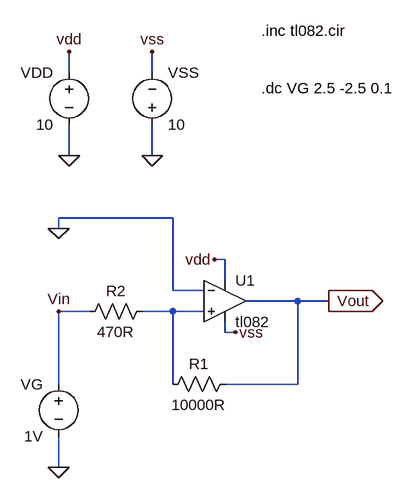
[diagram p0: schematic regfeedback.asc]
regfeedback.asc, the LTspice schematic file:
Version 4
SHEET 1 948 680
WIRE -64 -176 -64 -208
WIRE 64 -176 64 -208
WIRE -64 -48 -64 -96
WIRE 64 -48 64 -96
WIRE 96 48 -80 48
WIRE -80 64 -80 48
WIRE 176 112 160 112
WIRE 176 144 176 112
WIRE 96 160 96 48
WIRE 144 160 96 160
WIRE 288 176 208 176
WIRE 336 176 288 176
WIRE -32 192 -80 192
WIRE 96 192 48 192
WIRE 144 192 96 192
WIRE 176 224 176 208
WIRE 192 224 176 224
WIRE -80 304 -80 192
WIRE 96 304 96 192
WIRE 288 304 288 176
WIRE 288 304 176 304
WIRE -80 432 -80 384
FLAG -80 432 0
FLAG -64 -48 0
FLAG 64 -48 0
FLAG -64 -208 vdd
FLAG 160 112 vdd
FLAG 64 -208 vss
FLAG 192 224 vss
FLAG -80 192 Vin
FLAG -80 64 0
FLAG 336 176 Vout
IOPIN 336 176 Out
SYMBOL voltage -80 288 M0
WINDOW 123 0 0 Left 0
WINDOW 39 0 0 Left 0
SYMATTR InstName VG
SYMATTR Value 1V
SYMBOL voltage -64 -192 M0
SYMATTR InstName VDD
SYMATTR Value 10
SYMBOL voltage 64 -80 M180
WINDOW 0 24 96 Left 2
WINDOW 3 24 16 Left 2
SYMATTR InstName VSS
SYMATTR Value 10
SYMBOL Opamps\\opamp2 176 112 R0
SYMATTR InstName U1
SYMATTR Value tl082
SYMBOL res 192 288 R90
WINDOW 0 0 56 VBottom 2
WINDOW 3 32 56 VTop 2
SYMATTR InstName R1
SYMATTR Value 10000R
SYMBOL res 64 176 R90
WINDOW 0 0 56 VBottom 2
WINDOW 3 32 56 VTop 2
SYMATTR InstName R2
SYMATTR Value 470R
TEXT 232 -240 Left 2 !.inc tl082.cir
TEXT 232 -152 Left 2 !.dc VG 2.5 -2.5 0.1

The netlist it stands for:
* regfeedback.asc
VG Vin 0 1V
VDD vdd 0 10
VSS 0 vss 10
XU1 N001 0 vdd vss Vout tl082  ; pins In+ In- V+ V- OUT
R1 Vout N001 10000R
R2 N001 Vin 470R
.inc tl082.cir
.dc VG 2.5 -2.5 0.1
.backanno
.end